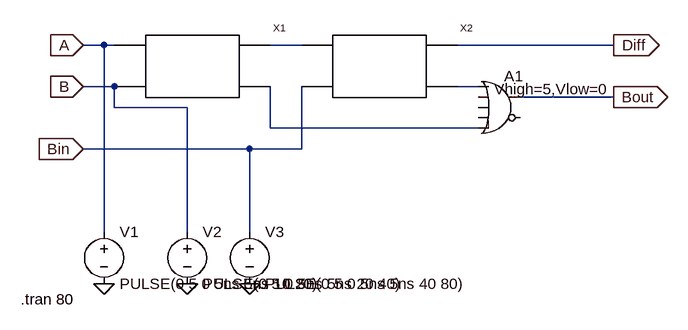
[diagram p0: schematic Full Subtracter.asc]
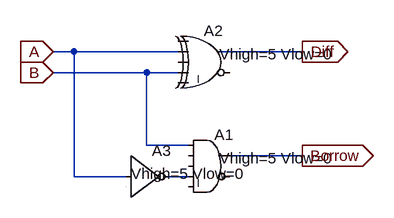
[diagram p1: sub-circuit halfsubtractor.asc]
Full Subtracter.asc, the LTspice schematic file:
Version 4
SHEET 1 880 680
WIRE -32 80 -64 80
WIRE -16 80 -32 80
WIRE 272 80 224 80
WIRE 752 80 512 80
WIRE -16 144 -64 144
WIRE 544 144 512 144
WIRE 752 160 608 160
WIRE -16 176 -16 144
WIRE 96 176 -16 176
WIRE 224 208 224 144
WIRE 544 208 224 208
WIRE 192 240 -64 240
WIRE 272 240 272 144
WIRE 272 240 192 240
WIRE -32 368 -32 80
WIRE 96 368 96 176
WIRE 192 368 192 240
FLAG -64 240 Bin
IOPIN -64 240 In
FLAG -64 144 B
IOPIN -64 144 In
FLAG -64 80 A
IOPIN -64 80 In
FLAG 752 80 Diff
IOPIN 752 80 Out
FLAG 752 160 Bout
IOPIN 752 160 Out
FLAG -32 448 0
FLAG 96 448 0
FLAG 192 448 0
SYMBOL halfSubtractor 96 112 R0
SYMATTR InstName X1
SYMBOL halfSubtractor 384 112 R0
SYMATTR InstName X2
SYMBOL Digital\\or 576 112 R0
WINDOW 3 -8 36 Left 2
SYMATTR InstName A1
SYMATTR Value Vhigh=5,Vlow=0
SYMBOL voltage -32 352 R0
WINDOW 123 0 0 Left 0
WINDOW 39 0 0 Left 0
SYMATTR InstName V1
SYMATTR Value PULSE(0 5 0 5ns 5ns 10 20)
SYMBOL voltage 96 352 R0
WINDOW 123 0 0 Left 0
WINDOW 39 0 0 Left 0
SYMATTR InstName V2
SYMATTR Value PULSE(0 5 0 5ns 5ns 20 40)
SYMBOL voltage 192 352 R0
WINDOW 123 0 0 Left 0
WINDOW 39 0 0 Left 0
SYMATTR InstName V3
SYMATTR Value PULSE(0 5 0 5ns 5ns 40 80)
TEXT -160 472 Left 2 !.tran 80

halfsubtractor.asc, the sub-circuit schematic file:
Version 4
SHEET 1 880 680
WIRE 16 16 -16 16
WIRE 176 16 16 16
WIRE 368 16 240 16
WIRE 128 48 -16 48
WIRE 176 48 128 48
WIRE 128 160 128 48
WIRE 192 160 128 160
WIRE 368 176 256 176
WIRE 16 208 16 16
WIRE 96 208 16 208
WIRE 192 208 160 208
FLAG -16 16 A
IOPIN -16 16 In
FLAG -16 48 B
IOPIN -16 48 In
FLAG 368 16 Diff
IOPIN 368 16 Out
FLAG 368 176 Borrow
IOPIN 368 176 Out
SYMBOL Digital\\and 224 128 R0
WINDOW 3 16 52 Left 2
SYMATTR InstName A1
SYMATTR Value Vhigh=5 Vlow=0
SYMBOL Digital\\xor 224 -32 R0
WINDOW 3 16 52 Left 2
SYMATTR InstName A2
SYMATTR Value Vhigh=5 Vlow=0
SYMBOL Digital\\inv 96 144 R0
WINDOW 3 8 60 Left 2
SYMATTR InstName A3
SYMATTR Value Vhigh=5 Vlow=0

The netlist it stands for:
* Full Subtracter.asc
XX1 A B N001 N003 halfsubtractor
XX2 N001 Bin Diff N002 halfsubtractor
A1 N002 0 0 0 N003 0 Bout 0 OR Vhigh=5,Vlow=0
V1 A 0 PULSE(0 5 0 5ns 5ns 10 20)
V2 B 0 PULSE(0 5 0 5ns 5ns 20 40)
V3 Bin 0 PULSE(0 5 0 5ns 5ns 40 80)

* block symbol definitions
.subckt halfsubtractor A B Diff Borrow
A1 B 0 0 N001 0 0 Borrow 0 AND Vhigh=5 Vlow=0
A2 0 A 0 B 0 0 Diff 0 XOR Vhigh=5 Vlow=0
A3 A 0 0 0 0 N001 0 0 BUF Vhigh=5 Vlow=0
.ends halfsubtractor

.tran 80
.backanno
.end